# Altium schematic sheet BMS_CORE.SchDoc
size A4; SheetNumber: 3; SheetTotal: 7
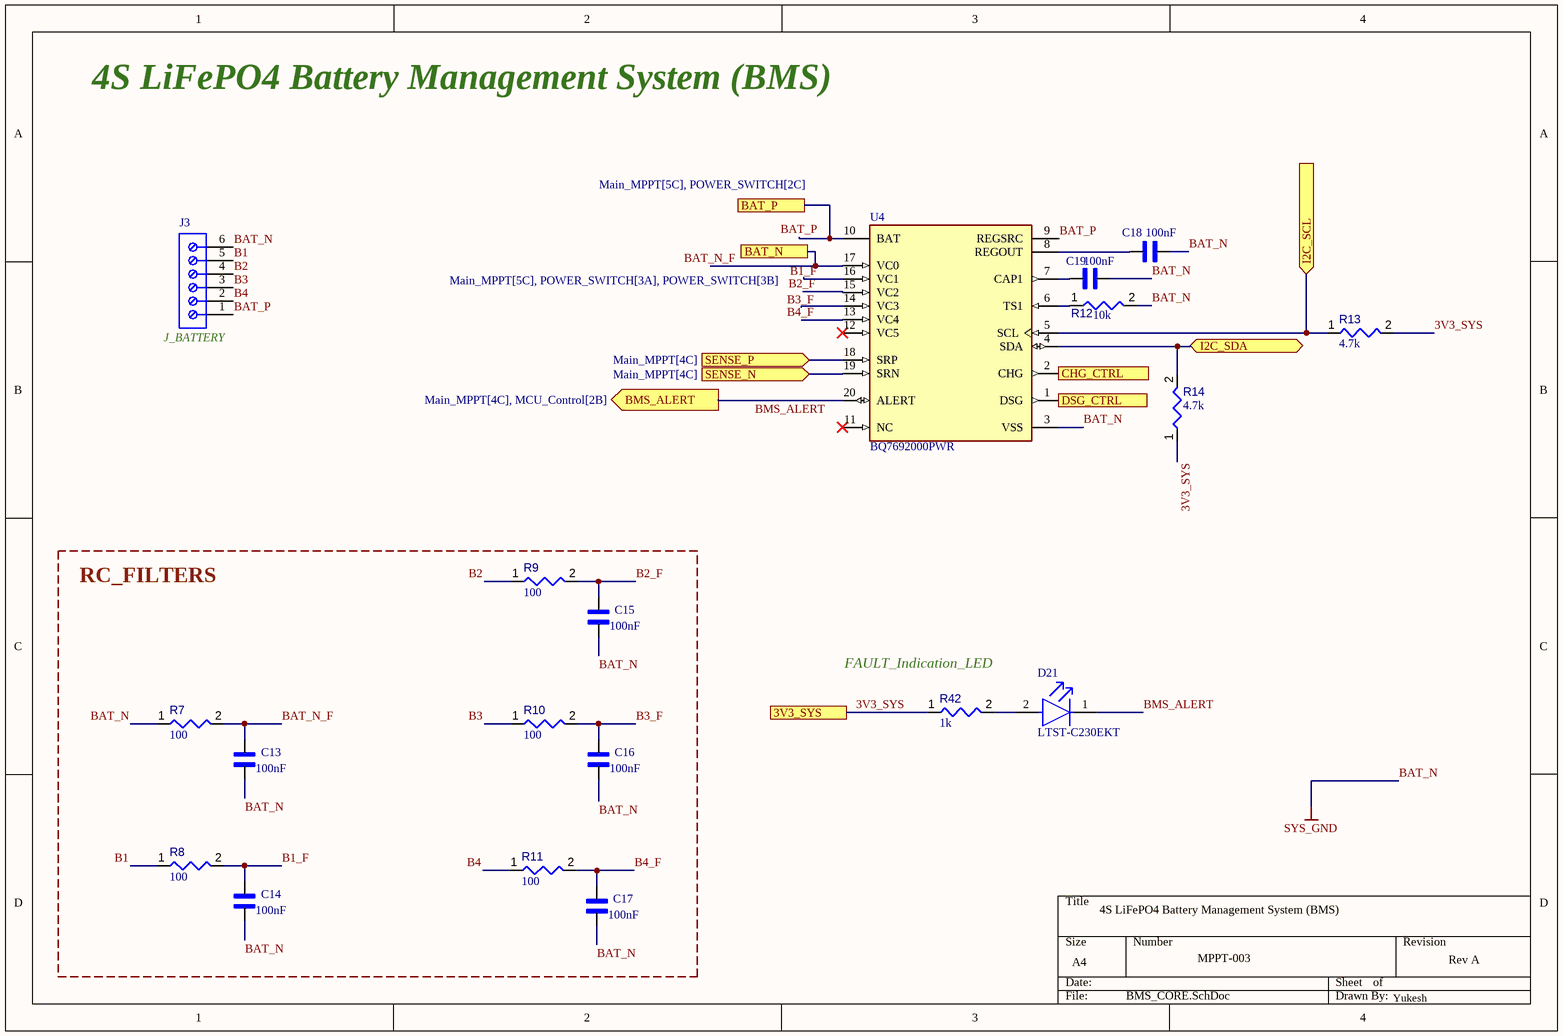
[diagram p0: BMS_CORE.SchDoc]

## Parts
C13  value 100nF  [CAPC1608X90N]  (hidden comment: 0603YC104KAZ2A)
C14  value 100nF  [CAPC1608X90N]  (hidden comment: 0603YC104KAZ2A)
C15  value 100nF  [CAPC1608X90N]  (hidden comment: 0603YC104KAZ2A)
C16  value 100nF  [CAPC1608X90N]  (hidden comment: 0603YC104KAZ2A)
C17  value 100nF  [CAPC1608X90N]  (hidden comment: 0603YC104KAZ2A)
C18  value 100nF  [CAPC1608X90N]  (hidden comment: 0603YC104KAZ2A)
C19  value 100nF  [CAPC1608X90N]  (hidden comment: 0603YC104KAZ2A)
D21  LTST-C230EKT  [FP-LTST-C230EKT-MFG]
J3  691244710006  [691244710006]  (value not drawn)
R7  value 100  [RESC0402(1005)_L]  (hidden comment: 100R2F)
R8  value 100  [RESC0402(1005)_L]  (hidden comment: 100R2F)
R9  value 100  [RESC0402(1005)_L]  (hidden comment: 100R2F)
R10  value 100  [RESC0402(1005)_L]  (hidden comment: 100R2F)
R11  value 100  [RESC0402(1005)_L]  (hidden comment: 100R2F)
R12  value 10k  [RESC0402(1005)_L]  (hidden comment: 10KR2F)
R13  value 4.7k  [RESC0402(1005)_L]  (hidden comment: 4D7KR2F)
R14  value 4.7k  [RESC0402(1005)_L]  (hidden comment: 4D7KR2F)
R42  value 1k  [RESC0402(1005)_L]  (hidden comment: 1KR2J)
U4  BQ7692000PWR  [FP-PW0020A-IPC_B]

## Blocks framed on the sheet
RC_FILTERS: C13-C17 R7-R11

## Ports
3V3_SYS (see Main_MPPT[4C], MCU_Control[2A], OUTPUT_CONNECTORS[4B], POWER_DISTRIBUTION[4C], POWER_SWITCH[2C], POWER_SWITCH[2D], USB_DEBUG[4B]), BAT_N (see Main_MPPT[5C], POWER_SWITCH[3A], POWER_SWITCH[3B]), BAT_P (see Main_MPPT[5C], POWER_SWITCH[2C]), BMS_ALERT (out, see Main_MPPT[4C], MCU_Control[2B]), CHG_CTRL (out, see Main_MPPT[5C], POWER_SWITCH[4B]), DSG_CTRL (out, see Main_MPPT[5C], POWER_SWITCH[4B]), I2C_SCL (in, see Main_MPPT[4C], MCU_Control[4B]), I2C_SDA (bidir, see Main_MPPT[4C], MCU_Control[4B]), SENSE_N (in, see Main_MPPT[4C]), SENSE_P (in, see Main_MPPT[4C])

## Nets
BAT_N: C13.1 C14.1 C15.1 C16.1 C17.1 C18.1 C19.1 J3.6 R7.1 R12.2 U4.3(VSS)  [also labelled SYS_GND]
3V3_SYS: R13.2 R14.1 R42.1 ; port 3V3_SYS
B1: J3.5 R8.1
B1_F: C14.2 R8.2 U4.16(VC1)
B2: J3.4 R9.1
B2_F: C15.2 R9.2 U4.15(VC2)
B3: J3.3 R10.1
B3_F: C16.2 R10.2 U4.14(VC3)
B4: J3.2 R11.1
B4_F: C17.2 R11.2 U4.13(VC4)
BAT_N_F: C13.2 R7.2 U4.17(VC0) ; port BAT_N
BAT_P: J3.1 U4.9(REGSRC) U4.10(BAT) ; port BAT_P
BMS_ALERT: D21.1(C) U4.20(ALERT) ; port BMS_ALERT
CHG_CTRL: U4.2(CHG) ; port CHG_CTRL
DSG_CTRL: U4.1(DSG) ; port DSG_CTRL
I2C_SCL: R13.1 U4.5(SCL) ; port I2C_SCL
I2C_SDA: R14.2 U4.4(SDA) ; port I2C_SDA
SENSE_N: U4.19(SRN) ; port SENSE_N
SENSE_P: U4.18(SRP) ; port SENSE_P
NetC18_2: C18.2 U4.8(REGOUT)
NetC19_2: C19.2 U4.7(CAP1)
NetD21_2: D21.2(A) R42.2
NetR12_1: R12.1 U4.6(TS1)

Not connected (* = marked no-connect by the designer): U4 11(NC)* 12(VC5)*

## Notes on the sheet
- 4S LiFePO4 Battery Management System (BMS)
- (near J3) J_BATTERY
- (near R42) FAULT_Indication_LED
- MPPT-003
- Rev A
- Yukesh

## Library data of the parts
C13-C19 = CMP-001-00089-1: Capacitor MLCC 0603 100nF 16V; MF: AVX; MP: 0603YC104KAZ2A; SnapEDA_Link: https://www.snapeda.com/parts/0603YC104KAZ2A/AVX/view-part/?ref=snap; Case/Package: 1608 AVX; Source: 0603YC104KAZ2A.SchLib; Check_prices: https://www.snapeda.com/parts/0603YC104KAZ2A/AVX/view-part/?ref=eda; Pins: 2; Design Item ID: 0603YC104KAZ2A; Component Type: Standard
D21 = CMP-22017-000030-1: LED RED CLEAR CHIP SMD; Forward Current: 30mA; Test Current: 10mA; Number of Elements: 1; Viewing Angle: 130°; Dominant Wavelength: 621nm; Forward Voltage: 2V; Lens Style: Diffused; Power Rating: 100mW; Reverse Voltage: 5V; Wavelength: 630nm; Luminous Intensity: 6mcd; Lens Color: Colorless; Case/Package: 1206; Case Code (Imperial): 1206; Package Quantity: 1; Lead Free: Lead Free; Case Code (Metric): 3216; Height: 1.1mm; Lens Transparency: Clear; Mount: Surface Mount; Depth: 1.6mm; Number of LEDs: 1; Power Dissipation: 100mW; Max Operating Temperature: 85°C; Width: 1.6mm; Color: Red; Number of Pins: 2; Min Operating Temperature: -55°C; Packaging: Tape and Reel; Radiation Hardening: No; Illumination Color: Red; Length: 3.2mm
J3 = CMP-1502-02578-3: Terminal Block, 5MM Pitch, Horizontal, Rising Cage Clamp, 12-30 AWG, 6 Pin
R7-R11 = CMP-009-00065-2: 100R 0.063W 1% 0402 (1005 Metric)  SMD; Power: 63mW; Tolerance: 1%; Case/Package: 0402; Pins: 2; Mounting Technology: SMT
R12 = CMP-009-00066-2: 10K 0.063W 1% 0402 (1005 Metric)  SMD; Power: 63mW; Case/Package: 0402; Mounting Technology: SMT; Pins: 2; Tolerance: 1%
R13 R14 = CMP-009-00105-2: 4K7 0.063W 1% 0402 (1005 Metric)  SMD; Power: 63mW; Mounting Technology: SMT; Case/Package: 0402; Tolerance: 1%; Pins: 2
R42 = CMP-009-00075-2: 1K 0.063W 5% 0402 (1005 Metric)  SMD; Power: 63mW; Pins: 2; Mounting Technology: SMT; Case/Package: 0402; Tolerance: 5%
U4 = CMP-04911-000068-1: IC BATT MON MULTI 3-5C 20TSSOP; Output Voltage: 3.6V; Fault Protection: Over Current; Min Supply Voltage: 6V; Max Supply Voltage: 25V; Interface: I2C; Case/Package: TSSOP; Min Operating Temperature: -40°C; RoHS Compliant: Yes; Weight: 0.002758oz; Lead Free: Lead Free; Packaging: Tape and Reel; Contact Plating: Gold; Mount: Surface Mount; Max Operating Temperature: 85°C; Number of Pins: 20; Package Quantity: 2000